# EAGLE design IO-shield (EAGLE 7.1.0)
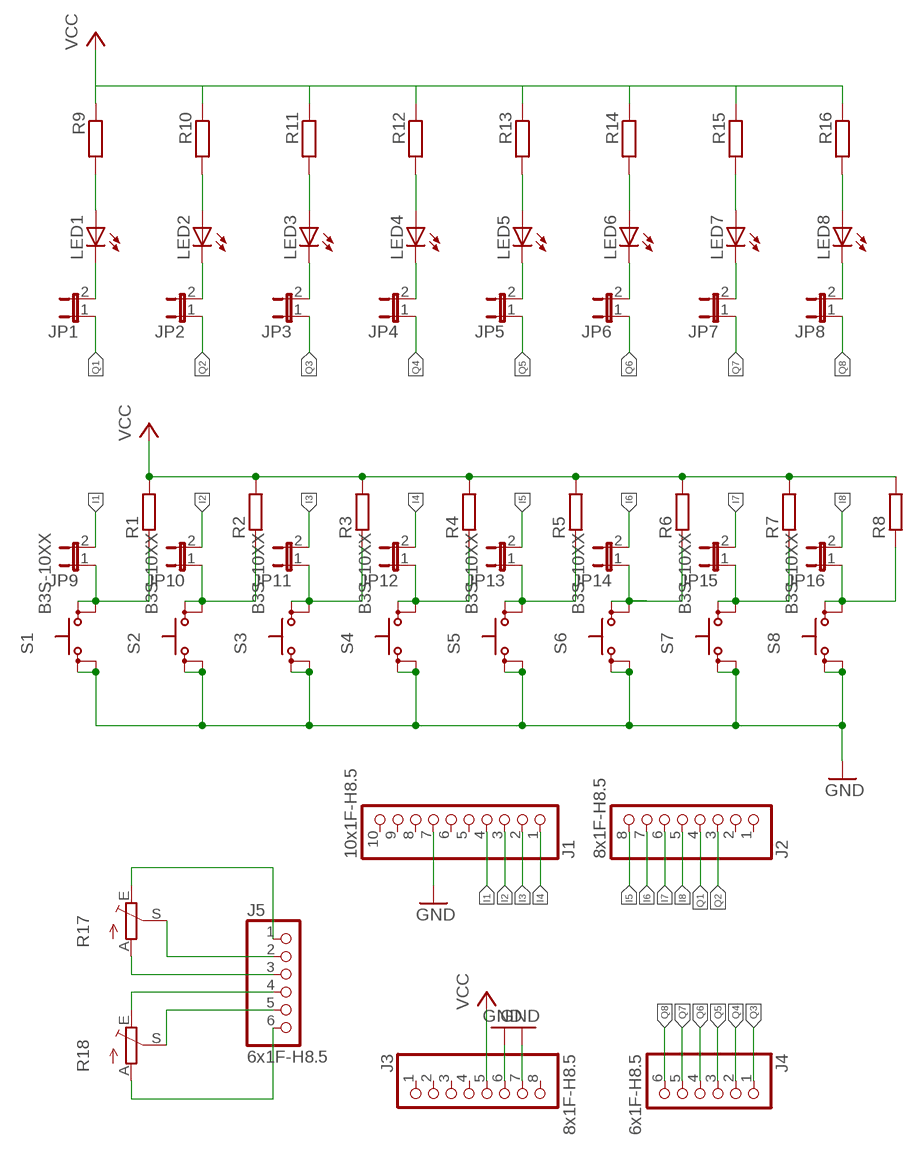
[diagram p0: schematic, sheet 1]

## Parts
J1  10x1F-H8.5  PINHD-1X10  [1X10]
J2  8x1F-H8.5  PINHD-1X8  [1X08]
J3  8x1F-H8.5  PINHD-1X8  [1X08]
J4  6x1F-H8.5  PINHD-1X6  [1X06]
J5  6x1F-H8.5  PINHD-1X6  [1X06]
JP1  JP1E  [JP1]
JP2  JP1E  [JP1]
JP3  JP1E  [JP1]
JP4  JP1E  [JP1]
JP5  JP1E  [JP1]
JP6  JP1E  [JP1]
JP7  JP1E  [JP1]
JP8  JP1E  [JP1]
JP9  JP1E  [JP1]
JP10  JP1E  [JP1]
JP11  JP1E  [JP1]
JP12  JP1E  [JP1]
JP13  JP1E  [JP1]
JP14  JP1E  [JP1]
JP15  JP1E  [JP1]
JP16  JP1E  [JP1]
LED1  LEDKA-3528ASYC  [KA-3528ASYC]
LED2  LEDKA-3528ASYC  [KA-3528ASYC]
LED3  LEDKA-3528ASYC  [KA-3528ASYC]
LED4  LEDKA-3528ASYC  [KA-3528ASYC]
LED5  LEDKA-3528ASYC  [KA-3528ASYC]
LED6  LEDKA-3528ASYC  [KA-3528ASYC]
LED7  LEDKA-3528ASYC  [KA-3528ASYC]
LED8  LEDKA-3528ASYC  [KA-3528ASYC]
R1  R-EU_M1206  [M1206]
R2  R-EU_M1206  [M1206]
R3  R-EU_M1206  [M1206]
R4  R-EU_M1206  [M1206]
R5  R-EU_M1206  [M1206]
R6  R-EU_M1206  [M1206]
R7  R-EU_M1206  [M1206]
R8  R-EU_M1206  [M1206]
R9  R-EU_M1206  [M1206]
R10  R-EU_M1206  [M1206]
R11  R-EU_M1206  [M1206]
R12  R-EU_M1206  [M1206]
R13  R-EU_M1206  [M1206]
R14  R-EU_M1206  [M1206]
R15  R-EU_M1206  [M1206]
R16  R-EU_M1206  [M1206]
R17  TRIM_EU-CA6V  [CA6V]
R18  TRIM_EU-CA6V  [CA6V]
S1  B3S-10XX  [B3S-10XX]
S2  B3S-10XX  [B3S-10XX]
S3  B3S-10XX  [B3S-10XX]
S4  B3S-10XX  [B3S-10XX]
S5  B3S-10XX  [B3S-10XX]
S6  B3S-10XX  [B3S-10XX]
S7  B3S-10XX  [B3S-10XX]
S8  B3S-10XX  [B3S-10XX]

## Nets
GND: J1.7 J3.6 J3.7 S1.1(P) S1.2(P1) S2.1(P) S2.2(P1) S3.1(P) S3.2(P1) S4.1(P) S4.2(P1) S5.1(P) S5.2(P1) S6.1(P) S6.2(P1) S7.1(P) S7.2(P1) S8.1(P) S8.2(P1)
I1: J1.4 JP9.2
I2: J1.3 JP10.2
I3: J1.2 JP11.2
I4: J1.1 JP12.2
I5: J2.8 JP13.2
I6: J2.7 JP14.2
I7: J2.6 JP15.2
I8: J2.5 JP16.2
N$1: JP1.2 LED1.C
N$2: JP2.2 LED2.C
N$3: JP9.1 R1.1 S1.3(S) S1.4(S1)
N$4: JP10.1 R2.1 S2.3(S) S2.4(S1)
N$5: JP11.1 R3.1 S3.3(S) S3.4(S1)
N$6: JP12.1 R4.1 S4.3(S) S4.4(S1)
N$7: JP13.1 R5.1 S5.3(S) S5.4(S1)
N$8: JP14.1 R6.1 S6.3(S) S6.4(S1)
N$9: LED1.A R9.2
N$10: LED2.A R10.2
N$11: LED3.A R11.2
N$12: LED4.A R12.2
N$13: LED5.A R13.2
N$14: LED6.A R14.2
N$15: LED7.A R15.2
N$16: LED8.A R16.2
N$17: JP15.1 R7.1 S7.3(S) S7.4(S1)
N$18: JP16.1 R8.1 S8.3(S) S8.4(S1)
N$19: JP3.2 LED3.C
N$20: JP4.2 LED4.C
N$21: JP5.2 LED5.C
N$22: JP6.2 LED6.C
N$23: JP7.2 LED7.C
N$24: JP8.2 LED8.C
N$25: J5.2 R17.S
N$26: J5.1 R17.E
N$27: J5.3 R17.A
N$28: J5.5 R18.S
N$29: J5.4 R18.E
N$30: J5.6 R18.A
Q1: J2.4 JP1.1
Q2: J2.3 JP2.1
Q3: J4.1 JP3.1
Q4: J4.2 JP4.1
Q5: J4.3 JP5.1
Q6: J4.4 JP6.1
Q7: J4.5 JP7.1
Q8: J4.6 JP8.1
VCC: J3.5 R1.2 R2.2 R3.2 R4.2 R5.2 R6.2 R7.2 R8.2 R9.1 R10.1 R11.1 R12.1 R13.1 R14.1 R15.1 R16.1
Unconnected: J1.5 J1.6 J1.8 J1.9 J1.10 J2.1 J2.2 J3.1 J3.2 J3.3 J3.4 J3.8

## Library data of the parts
J1 = SmartPrj:PINHD-1X10: PIN HEADER
J2 J3 = SmartPrj:PINHD-1X8: PIN HEADER
J4 J5 = SmartPrj:PINHD-1X6: PIN HEADER
JP1-JP16 = jumper:JP1E: JUMPER
LED1-LED8 = led:LED: LED OSRAM: - CHIPLED LG R971, LG N971, LY N971, LG Q971, LY Q971, LO R971, LY R971 LH N974, LH R974 LS Q976, LO Q976, LY Q976 LO Q996 - Hyper CHIPLED LW Q18S LB Q993, LB Q99A, LB R99A - SideLED LS A670, LO A670, LY A670, LG A670, LP A670 LB A673, LV A673, LT A673, LW A673 LH A674 LY A675 LS A676, LA A676, LO A676, LY A676, LW A676 LS A679, LY A679, LG A679 - Hyper Micro SIDELED® LS Y876, LA Y876, LO Y876, LY Y876 LT Y87S - SmartLED LW L88C, LW L88S LB L89C, LB L89S, LG L890 LS L89K, LO L89K, LY L89K LS L896, LA L896, LO L896, LY L896 - TOPLED LS T670, LO T670, LY T670, LG T670, LP T670 LSG T670, LSP T670, LSY T670, LOP T670, LYG T670 LG T671, LOG T671, LSG T671 LB T673, LV T673, LT T673, LW T673 LH T674 LS T676, LA T676, LO T676, LY T676, LB T676, LH T676, LSB T676, LW T676 LB T67C, LV T67C, LT T67C, LS T67K, LO T67K, LY T67K, LW E67C LS E67B, LA E67B, LO E67B, LY E67B, LB E67C, LV E67C, LT E67C LW T67C LS T679, LY T679, LG T679 LS T770, LO T770, LY T770, LG T770, LP T770 LB T773, LV T773, LT T773, LW T773 LH T774 LS E675, LA E675, LY E675, LS T675 LS T776, LA T776, LO T776, LY T776, LB T776 LHGB T686 LT T68C, LB T68C - Hyper Mini TOPLED® LB M676 - Mini TOPLED Santana® LG M470 LS M47K, LO M47K, LY M47K Source: http://www.osram.convergy.de LUXEON: - LUMILED® LXK2-PW12-R00, LXK2-PW12-S00, LXK2-PW14-U00, LXK2-PW14-V00 LXK2-PM12-R00, LXK2-PM12-S00, LXK2-PM14-U00 LXK2-PE12-Q00, LXK2-PE12-R00, LXK2-PE12-S00, LXK2-PE14-T00, LXK2-PE14-U00 LXK2-PB12-K00, LXK2-PB12-L00, LXK2-PB12-M00, LXK2-PB14-N00, LXK2-PB14-P00, LXK2-PB14-Q00 LXK2-PR12-L00, LXK2-PR12-M00, LXK2-PR14-Q00, LXK2-PR14-R00 LXK2-PD12-Q00, LXK2-PD12-R00, LXK2-PD12-S00 LXK2-PH12-R00, LXK2-PH12-S00 LXK2-PL12-P00, LXK2-PL12-Q00, LXK2-PL12-R00 Source: www.luxeon.com KINGBRIGHT: KA-3528ASYC Source: www.kingbright.com
R1-R16 = rcl:R-EU_: RESISTOR, European symbol
R17 R18 = pot:TRIM_EU-: POTENTIOMETER
S1-S8 = switch-omron2:B3S-10XX: SMD Tactile Switch

## Net classes
0 default: width 0.254 mm, drill 0.61 mm, clearance 0.254 mm
1 power: width 0.254 mm, drill 0.61 mm, clearance 0.254 mm
2 gnd: width 0.254 mm, drill 0.61 mm, clearance 0.254 mm
3 usbvcc: width 0.254 mm, drill 0.61 mm, clearance 0.254 mm
4 aref: width 0.254 mm, drill 0.61 mm, clearance 0.254 mm

## Board
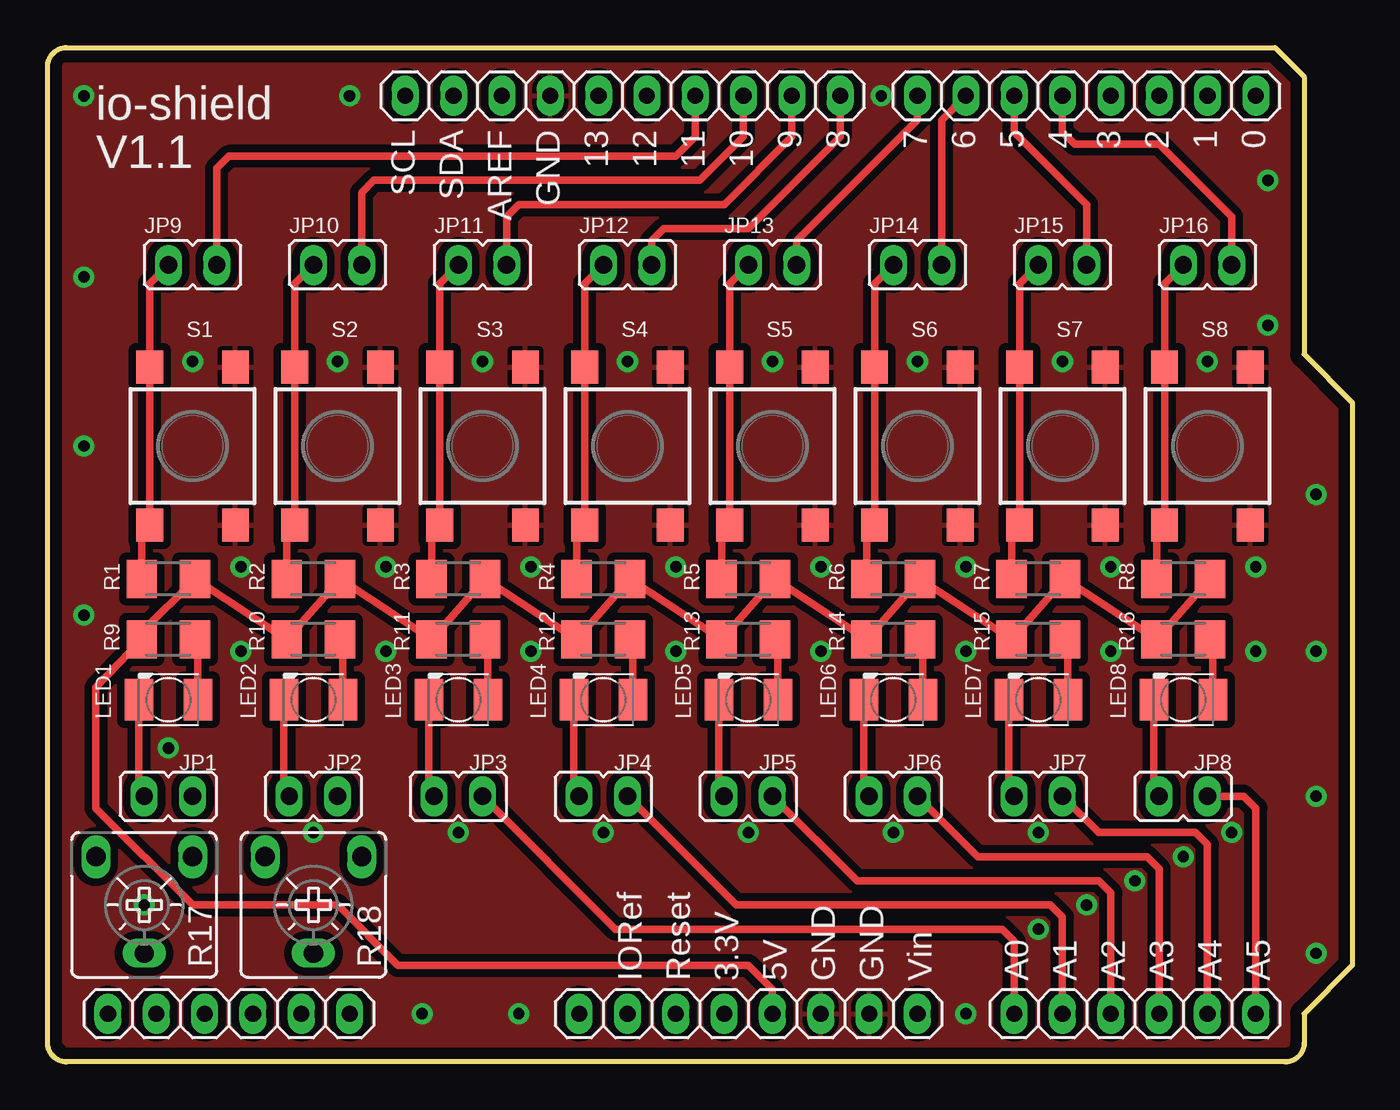
[diagram p1: board, top side]
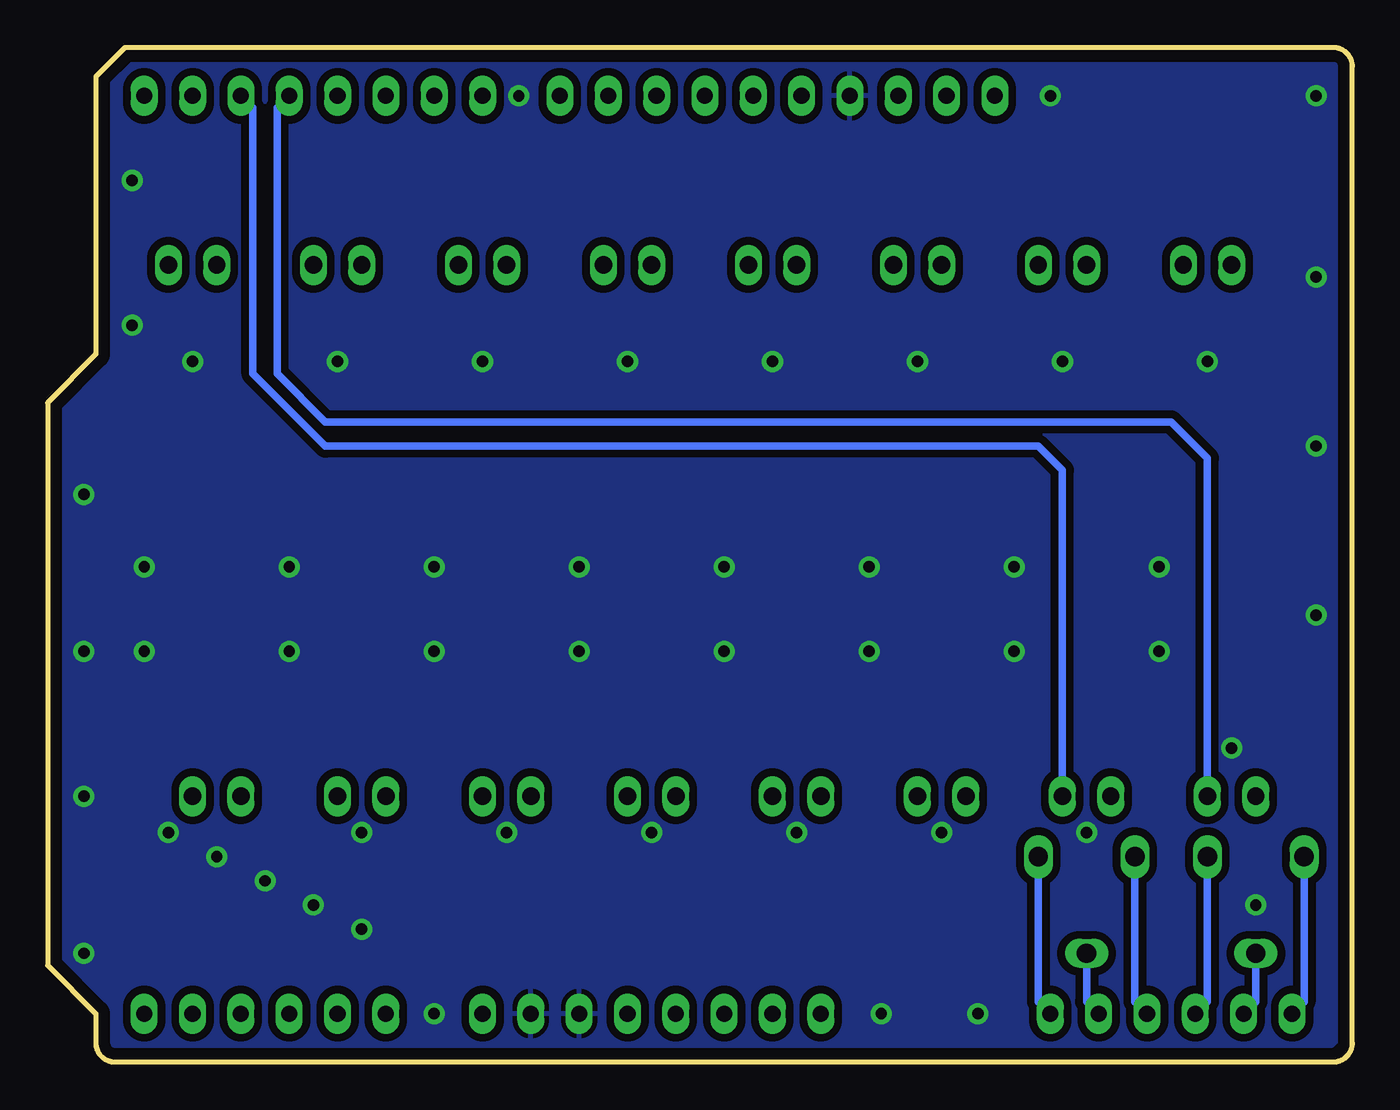
[diagram p2: board, bottom side, seen from below]

Size 68.58 x 53.34 mm. Coordinates in mm from the lower left corner, seen from the top.
Outline: 64.52,53.34 66.04,51.82 66.04,37.21 68.58,34.67 68.58,5.08 66.04,2.54 66.04,1 arc-90 65.04,0 1,0 arc-90 0,1 0,52.34 arc-90 1,53.34 64.52,53.34
Copper layers (1*16): Top 0.035mm / dielectric 1.5mm / Bottom 0.035mm
Design rules "default": minimum track width 10mil, minimum drill 22mil, track to track 10mil, track to pad 10mil, pad to pad 8mil, via to via 12mil, smd to smd 8mil, copper to edge 24mil, drill to drill 12mil, minimum pad ring 10mil, minimum via ring 10mil, stop-mask expansion 2mil, vias tented up to drill 30mil, thermal gap 10mil
vRestrict: area 42.5,38.6 to 43.1,38.9; area 35.8,35.2 to 36.4,35.7; area 44.5,35.2 to 45.2,35.7; area 41.3,35.2 to 41.8,35.7; area 47.9,10.3 to 48.5,10.8; area 50.4,10.2 to 50.9,11

### Footprints (pad centres in the part's own frame; a part is rotated, then mirrored left to right if it is on the bottom)
1X10 = drill 0.85 pad 1.422 long: 1 -11.43,0; 2 -8.89,0; 3 -6.35,0; 4 -3.81,0; 5 -1.27,0; 6 1.27,0; 7 3.81,0; 8 6.35,0; 9 8.89,0; 10 11.43,0
1X08 = drill 0.85 pad 1.422 long: 1 -8.89,0; 2 -6.35,0; 3 -3.81,0; 4 -1.27,0; 5 1.27,0; 6 3.81,0; 7 6.35,0; 8 8.89,0
1X06 = drill 0.85 pad 1.422 long: 1 -6.35,0; 2 -3.81,0; 3 -1.27,0; 4 1.27,0; 5 3.81,0; 6 6.35,0
JP1 = drill 0.914 long: 1 0,-1.27; 2 0,1.27
KA-3528ASYC = smd 1.5 x 2.2: A -1.55,0; C 1.55,0
M1206 = smd 1.6 x 2: 1 -1.4,0; 2 1.4,0
CA6V = drill 1.016 long: A -2.54,-2.54; E 2.54,-2.54; S 0,2.54
B3S-10XX = smd 1.75 x 1.4: 1 -4.15,2.25; 2 4.15,2.25; 3 -4.15,-2.25; 4 4.15,-2.25

### Placement (x,y rotation side)
J1  30.23,50.8 180 top
J2  54.61,50.8 180 top
J3  36.83,2.54 0 top
J4  57.15,2.54 0 top
J5  9.53,2.54 0 top
JP1  6.35,13.97 90 top
JP2  13.97,13.97 90 top
JP3  21.59,13.97 90 top
JP4  29.21,13.97 90 top
JP5  36.83,13.97 90 top
JP6  44.45,13.97 90 top
JP7  52.07,13.97 90 top
JP8  59.69,13.97 90 top
JP9  7.62,41.91 270 top
JP10  15.24,41.91 270 top
JP11  22.86,41.91 270 top
JP12  30.48,41.91 270 top
JP13  38.1,41.91 270 top
JP14  45.72,41.91 270 top
JP15  53.34,41.91 270 top
JP16  60.96,41.91 270 top
LED1  6.35,19.05 180 top
LED2  13.97,19.05 180 top
LED3  21.59,19.05 180 top
LED4  29.21,19.05 180 top
LED5  36.83,19.05 180 top
LED6  44.45,19.05 180 top
LED7  52.07,19.05 180 top
LED8  59.69,19.05 180 top
R1  6.35,25.4 0 top
R2  13.97,25.4 0 top
R3  21.59,25.4 0 top
R4  29.21,25.4 0 top
R5  36.83,25.4 0 top
R6  44.45,25.4 0 top
R7  52.07,25.4 0 top
R8  59.69,25.4 0 top
R9  6.35,22.23 0 top
R10  13.97,22.23 0 top
R11  21.59,22.23 0 top
R12  29.21,22.23 0 top
R13  36.83,22.23 0 top
R14  44.45,22.23 0 top
R15  52.07,22.23 0 top
R16  59.69,22.23 0 top
R17  5.08,8.26 180 top
R18  13.97,8.26 180 top
S1  7.62,32.38 270 top
S2  15.24,32.38 270 top
S3  22.86,32.38 270 top
S4  30.48,32.38 270 top
S5  38.1,32.38 270 top
S6  45.72,32.38 270 top
S7  53.34,32.38 270 top
S8  60.96,32.38 270 top

### Tracks (layer width: path | path; a pad name or v marks a point on that pad's centre or on a via)
GND  (via drill 0.6)
  other vias: 19.68,2.54 24.77,2.54 6.35,16.51 21.59,12.06 25.4,21.59 33.02,21.59 44.45,12.06 29.21,12.06 36.83,12.06 5.08,8.26 10.16,21.59 17.78,21.59 40.64,21.59 48.26,21.59 55.88,21.59 63.5,21.59 48.26,2.54 52.07,6.99 54.61,8.26 57.15,9.53 59.69,10.79 62.23,12.06 52.07,12.06 13.97,12.06 10.16,26.04 17.78,26.04 25.4,26.04 33.02,26.04 40.64,26.04 48.26,26.04 55.88,26.04 63.5,26.04 7.62,36.83 15.24,36.83 22.86,36.83 30.48,36.83 38.1,36.83 45.72,36.83 53.34,36.83 60.96,36.83 15.88,50.8 1.91,50.8 1.91,41.27 1.91,32.38 1.91,23.5 66.67,5.71 66.67,13.97 66.67,21.59 66.67,29.84 64.14,38.73 64.14,46.35 43.81,50.8
  pour Bottom (isolate 0.406, rank 2): 0.64,52.7 69.22,52.7 69.22,0.64 1.64,0.64 arc-90 0.64,1.64
  pour Top (isolate 0.406, rank 2): 0.64,52.7 69.22,52.7 69.22,1.64 arc-90 68.22,0.64 1.64,0.64 arc-90 0.64,1.64
I1
  Top 0.406: JP9.2 8.89,46.99 9.53,47.62 33.02,47.62 34.04,48.64 J1.4
I2
  Top 0.406: JP10.2 16.51,45.72 17.14,46.35 34.29,46.35 36.58,48.64 J1.3
I3
  Top 0.406: JP11.2 24.13,44.45 24.77,45.09 35.56,45.09 39.12,48.64 J1.2
I4
  Top 0.406: JP12.2 31.75,43.18 32.38,43.81 36.83,43.81 41.66,48.64 J1.1
I5
  Top 0.406: JP13.2 39.37,43.18 45.72,49.53 J2.8
I6
  Top 0.406: JP14.2 46.99,49.53 J2.7
I7
  Top 0.406: JP15.2 54.61,45.09 50.8,48.9 J2.6
I8
  Top 0.406: JP16.2 62.23,44.45 58.42,48.26 53.98,48.26 53.34,48.9 J2.5
N$1
  Top 0.406: LED1.C 4.8,14.25 JP1.2
N$2
  Top 0.406: LED2.C 12.42,14.25 JP2.2
N$3
  Top 0.406: R1.1 4.95,27.82 S1.4 S1.3 5.37,40.93 JP9.1
N$4
  Top 0.406: R2.1 12.57,27.82 S2.4 S2.3 12.99,40.93 JP10.1
N$5
  Top 0.406: R3.1 20.19,27.82 S3.4 S3.3 20.61,40.93 JP11.1
N$6
  Top 0.406: R4.1 27.81,27.82 S4.4 S4.3 28.23,40.93 JP12.1
N$7
  Top 0.406: R5.1 35.43,27.82 S5.4 S5.3 35.85,40.93 JP13.1
N$8
  Top 0.406: R6.1 43.05,27.82 S6.4 S6.3 43.47,40.93 JP14.1
N$9
  Top 0.406: LED1.A 7.9,22.07 R9.2
N$10
  Top 0.406: LED2.A 15.52,22.07 R10.2
N$11
  Top 0.406: LED3.A 23.14,22.07 R11.2
N$12
  Top 0.406: LED4.A 30.76,22.07 R12.2
N$13
  Top 0.406: LED5.A 38.38,22.07 R13.2
N$14
  Top 0.406: LED6.A 46,22.07 R14.2
N$15
  Top 0.406: LED7.A 53.62,22.07 R15.2
N$16
  Top 0.406: LED8.A 61.24,22.07 R16.2
N$17
  Top 0.406: R7.1 50.67,27.82 S7.4 S7.3 51.09,40.93 JP15.1
N$18
  Top 0.406: R8.1 58.29,27.82 S8.4 S8.3 58.71,40.93 JP16.1
N$19
  Top 0.406: LED3.C 20.04,14.25 JP3.2
N$20
  Top 0.406: LED4.C 27.66,14.25 JP4.2
N$21
  Top 0.406: LED5.C 35.28,14.25 JP5.2
N$22
  Top 0.406: LED6.C 42.9,14.25 JP6.2
N$23
  Top 0.406: LED7.C 50.52,14.25 JP7.2
N$24
  Top 0.406: LED8.C 58.14,14.25 JP8.2
N$25
  Bottom 0.406: R17.S 5.08,3.17 J5.2
N$26
  Bottom 0.406: R17.E 2.54,3.17 J5.1
N$27
  Bottom 0.406: R17.A 7.62,3.17 J5.3
N$28
  Bottom 0.406: R18.S 13.97,3.17 J5.5
N$29
  Bottom 0.406: R18.E 11.43,3.17 J5.4
N$30
  Bottom 0.406: R18.A 16.51,3.17 J5.6
Q1
  Bottom 0.406: JP1.1 7.62,31.75 9.53,33.66 53.98,33.66 56.52,36.2 56.52,50.16 J2.4
Q2
  Bottom 0.406: JP2.1 15.24,31.11 16.51,32.38 53.98,32.38 57.78,36.2 57.78,50.16 J2.3
Q3
  Top 0.406: J4.1 50.8,6.35 50.16,6.99 29.84,6.99 JP3.1
Q4
  Top 0.406: J4.2 53.34,7.62 52.7,8.26 36.2,8.26 JP4.1
Q5
  Top 0.406: J4.3 55.88,8.89 55.24,9.53 42.55,9.53 JP5.1
Q6
  Top 0.406: J4.4 58.42,10.16 57.78,10.79 48.9,10.79 JP6.1
Q7
  Top 0.406: J4.5 60.96,11.43 60.33,12.06 55.24,12.06 JP7.1
Q8
  Top 0.406: J4.6 63.5,13.34 62.87,13.97 JP8.1
VCC
  Top 0.406: R8.2 R16.1 R7.2 R15.1 R6.2 R14.1 R5.2 R13.1 R4.2 R12.1 R3.2 R11.1 R2.2 R10.1 R1.2 4.95,22.6 R9.1 2.54,19.68 2.54,13.34 7.62,8.26 15.24,8.26 18.41,5.08 36.83,5.08 38.1,3.81 J3.5

### Text on the board
tPlace: io-shield | SCL | SDA | AREF | GND | 13 | 12 | 11 | 10 | 9 | 8 | 7 | 6 | 5 | 4 | 3 | 2 | 1 | 0 | V1.1
tNames: IORef | Reset | 3.3V | 5V | GND | GND | Vin | A0 | A1 | A2 | A3 | A4 | A5
ReferenceLC: X2